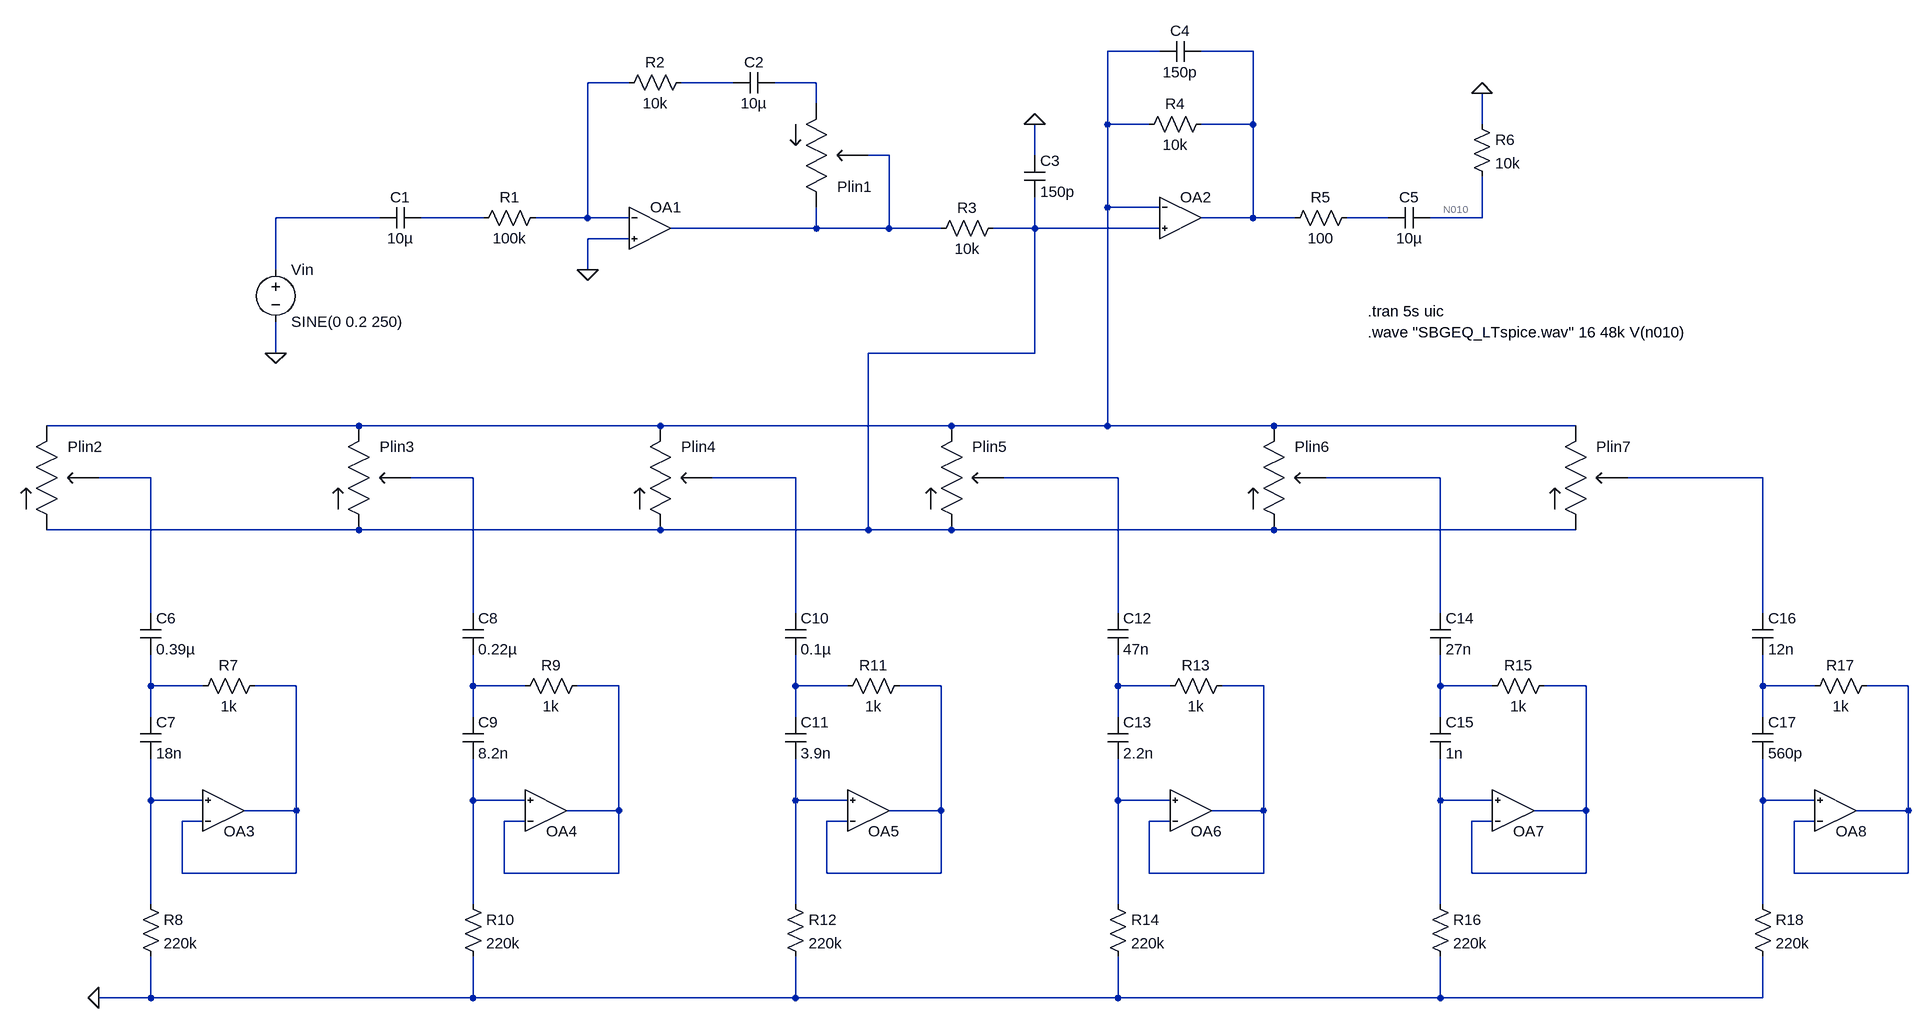
[diagram p0: schematic SBGEQ.asc]
SBGEQ.asc, the LTspice schematic file:
Version 4
SHEET 1 1816 1092
WIRE 336 -384 256 -384
WIRE 480 -384 400 -384
WIRE -480 -336 -544 -336
WIRE -320 -336 -400 -336
WIRE -192 -336 -256 -336
WIRE -192 -304 -192 -336
WIRE 256 -272 256 -384
WIRE 320 -272 256 -272
WIRE 480 -272 480 -384
WIRE 480 -272 400 -272
WIRE 832 -272 832 -320
WIRE -80 -224 -112 -224
WIRE 144 -224 144 -272
WIRE 256 -144 256 -272
WIRE 336 -144 256 -144
WIRE -864 -128 -1024 -128
WIRE -704 -128 -800 -128
WIRE -544 -128 -544 -336
WIRE -544 -128 -624 -128
WIRE -480 -128 -544 -128
WIRE 480 -128 480 -272
WIRE 480 -128 400 -128
WIRE 544 -128 480 -128
WIRE 688 -128 624 -128
WIRE 832 -128 832 -192
WIRE 832 -128 752 -128
WIRE -192 -112 -192 -144
WIRE -192 -112 -416 -112
WIRE -80 -112 -80 -224
WIRE -80 -112 -192 -112
WIRE 0 -112 -80 -112
WIRE 144 -112 144 -160
WIRE 144 -112 80 -112
WIRE 336 -112 144 -112
WIRE -480 -96 -544 -96
WIRE -1024 -48 -1024 -128
WIRE -544 -48 -544 -96
WIRE -1024 80 -1024 32
WIRE 144 80 144 -112
WIRE 144 80 -112 80
WIRE -896 192 -1376 192
WIRE -432 192 -896 192
WIRE 16 192 -432 192
WIRE 256 192 256 -144
WIRE 256 192 16 192
WIRE 512 192 256 192
WIRE 976 192 512 192
WIRE -1216 272 -1296 272
WIRE -720 272 -816 272
WIRE -224 272 -352 272
WIRE 272 272 96 272
WIRE 768 272 592 272
WIRE 1264 272 1056 272
WIRE -896 352 -1376 352
WIRE -432 352 -896 352
WIRE -112 352 -112 80
WIRE -112 352 -432 352
WIRE 16 352 -112 352
WIRE 512 352 16 352
WIRE 976 352 512 352
WIRE -1216 480 -1216 272
WIRE -720 480 -720 272
WIRE -224 480 -224 272
WIRE 272 480 272 272
WIRE 768 480 768 272
WIRE 1264 480 1264 272
WIRE -1216 592 -1216 544
WIRE -1136 592 -1216 592
WIRE -992 592 -1056 592
WIRE -720 592 -720 544
WIRE -640 592 -720 592
WIRE -496 592 -560 592
WIRE -224 592 -224 544
WIRE -144 592 -224 592
WIRE 0 592 -64 592
WIRE 272 592 272 544
WIRE 352 592 272 592
WIRE 496 592 432 592
WIRE 768 592 768 544
WIRE 848 592 768 592
WIRE 992 592 928 592
WIRE 1264 592 1264 544
WIRE 1344 592 1264 592
WIRE 1488 592 1424 592
WIRE -1216 640 -1216 592
WIRE -720 640 -720 592
WIRE -224 640 -224 592
WIRE 272 640 272 592
WIRE 768 640 768 592
WIRE 1264 640 1264 592
WIRE -1216 768 -1216 704
WIRE -1136 768 -1216 768
WIRE -720 768 -720 704
WIRE -640 768 -720 768
WIRE -224 768 -224 704
WIRE -144 768 -224 768
WIRE 272 768 272 704
WIRE 352 768 272 768
WIRE 768 768 768 704
WIRE 848 768 768 768
WIRE 1264 768 1264 704
WIRE 1344 768 1264 768
WIRE -992 784 -992 592
WIRE -992 784 -1072 784
WIRE -496 784 -496 592
WIRE -496 784 -576 784
WIRE 0 784 0 592
WIRE 0 784 -80 784
WIRE 496 784 496 592
WIRE 496 784 416 784
WIRE 992 784 992 592
WIRE 992 784 912 784
WIRE 1488 784 1488 592
WIRE 1488 784 1408 784
WIRE -1136 800 -1168 800
WIRE -640 800 -672 800
WIRE -144 800 -176 800
WIRE 352 800 320 800
WIRE 848 800 816 800
WIRE 1344 800 1312 800
WIRE -1168 880 -1168 800
WIRE -992 880 -992 784
WIRE -992 880 -1168 880
WIRE -672 880 -672 800
WIRE -496 880 -496 784
WIRE -496 880 -672 880
WIRE -176 880 -176 800
WIRE 0 880 0 784
WIRE 0 880 -176 880
WIRE 320 880 320 800
WIRE 496 880 496 784
WIRE 496 880 320 880
WIRE 816 880 816 800
WIRE 992 880 992 784
WIRE 992 880 816 880
WIRE 1312 880 1312 800
WIRE 1488 880 1488 784
WIRE 1488 880 1312 880
WIRE -1216 928 -1216 768
WIRE -720 928 -720 768
WIRE -224 928 -224 768
WIRE 272 928 272 768
WIRE 768 928 768 768
WIRE 1264 928 1264 768
WIRE -1216 1072 -1216 1008
WIRE -1216 1072 -1296 1072
WIRE -720 1072 -720 1008
WIRE -720 1072 -1216 1072
WIRE -224 1072 -224 1008
WIRE -224 1072 -720 1072
WIRE 272 1072 272 1008
WIRE 272 1072 -224 1072
WIRE 768 1072 768 1008
WIRE 768 1072 272 1072
WIRE 1264 1072 1264 1008
WIRE 1264 1072 768 1072
FLAG 144 -272 0
FLAG -1024 80 0
FLAG 832 -320 0
FLAG -544 -48 0
FLAG -1296 1072 0
SYMBOL voltage -1024 -64 R0
SYMATTR InstName Vin
SYMATTR Value SINE(0 0.2 250)
SYMBOL cap -800 -144 R90
WINDOW 0 0 32 VBottom 2
WINDOW 3 32 32 VTop 2
SYMATTR InstName C1
SYMATTR Value 10µ
SYMBOL res -608 -144 R90
WINDOW 0 0 56 VBottom 2
WINDOW 3 32 56 VTop 2
SYMATTR InstName R1
SYMATTR Value 100k
SYMBOL IdealOpamp -448 -112 R0
SYMATTR InstName OA1
SYMBOL res -384 -352 R90
WINDOW 0 0 56 VBottom 2
WINDOW 3 32 56 VTop 2
SYMATTR InstName R2
SYMATTR Value 10k
SYMBOL cap -256 -352 R90
WINDOW 0 0 32 VBottom 2
WINDOW 3 32 32 VTop 2
SYMATTR InstName C2
SYMATTR Value 10µ
SYMBOL LinearPotentiometer -192 -224 R0
SYMATTR InstName Plin1
SYMATTR SpiceLine Rp=250k x=0.5
SYMBOL res 96 -128 R90
WINDOW 0 0 56 VBottom 2
WINDOW 3 32 56 VTop 2
SYMATTR InstName R3
SYMATTR Value 10k
SYMBOL cap 128 -224 R0
SYMATTR InstName C3
SYMATTR Value 150p
SYMBOL IdealOpamp 368 -128 R0
SYMATTR InstName OA2
SYMBOL res 416 -288 R90
WINDOW 0 0 56 VBottom 2
WINDOW 3 32 56 VTop 2
SYMATTR InstName R4
SYMATTR Value 10k
SYMBOL cap 400 -400 R90
WINDOW 0 0 32 VBottom 2
WINDOW 3 32 32 VTop 2
SYMATTR InstName C4
SYMATTR Value 150p
SYMBOL res 640 -144 R90
WINDOW 0 0 56 VBottom 2
WINDOW 3 32 56 VTop 2
SYMATTR InstName R5
SYMATTR Value 100
SYMBOL cap 752 -144 R90
WINDOW 0 0 32 VBottom 2
WINDOW 3 32 32 VTop 2
SYMATTR InstName C5
SYMATTR Value 10µ
SYMBOL res 816 -288 R0
SYMATTR InstName R6
SYMATTR Value 10k
SYMBOL IdealOpamp -1104 784 M180
SYMATTR InstName OA3
SYMBOL LinearPotentiometer -1376 272 M180
SYMATTR InstName Plin2
SYMATTR SpiceLine Rp=5k x=0.5
SYMBOL cap -1232 480 R0
SYMATTR InstName C6
SYMATTR Value 0.39µ
SYMBOL cap -1232 640 R0
SYMATTR InstName C7
SYMATTR Value 18n
SYMBOL res -1040 576 R90
WINDOW 0 0 56 VBottom 2
WINDOW 3 32 56 VTop 2
SYMATTR InstName R7
SYMATTR Value 1k
SYMBOL res -1232 912 R0
SYMATTR InstName R8
SYMATTR Value 220k
SYMBOL IdealOpamp -608 784 M180
SYMATTR InstName OA4
SYMBOL LinearPotentiometer -896 272 M180
SYMATTR InstName Plin3
SYMATTR SpiceLine Rp=5k x=0.5
SYMBOL cap -736 480 R0
SYMATTR InstName C8
SYMATTR Value 0.22µ
SYMBOL cap -736 640 R0
SYMATTR InstName C9
SYMATTR Value 8.2n
SYMBOL res -544 576 R90
WINDOW 0 0 56 VBottom 2
WINDOW 3 32 56 VTop 2
SYMATTR InstName R9
SYMATTR Value 1k
SYMBOL res -736 912 R0
SYMATTR InstName R10
SYMATTR Value 220k
SYMBOL IdealOpamp -112 784 M180
SYMATTR InstName OA5
SYMBOL LinearPotentiometer -432 272 M180
SYMATTR InstName Plin4
SYMATTR SpiceLine Rp=5k x=0.5
SYMBOL cap -240 480 R0
SYMATTR InstName C10
SYMATTR Value 0.1µ
SYMBOL cap -240 640 R0
SYMATTR InstName C11
SYMATTR Value 3.9n
SYMBOL res -48 576 R90
WINDOW 0 0 56 VBottom 2
WINDOW 3 32 56 VTop 2
SYMATTR InstName R11
SYMATTR Value 1k
SYMBOL res -240 912 R0
SYMATTR InstName R12
SYMATTR Value 220k
SYMBOL IdealOpamp 384 784 M180
SYMATTR InstName OA6
SYMBOL LinearPotentiometer 16 272 M180
SYMATTR InstName Plin5
SYMATTR SpiceLine Rp=5k x=0.5
SYMBOL cap 256 480 R0
SYMATTR InstName C12
SYMATTR Value 47n
SYMBOL cap 256 640 R0
SYMATTR InstName C13
SYMATTR Value 2.2n
SYMBOL res 448 576 R90
WINDOW 0 0 56 VBottom 2
WINDOW 3 32 56 VTop 2
SYMATTR InstName R13
SYMATTR Value 1k
SYMBOL res 256 912 R0
SYMATTR InstName R14
SYMATTR Value 220k
SYMBOL IdealOpamp 880 784 M180
SYMATTR InstName OA7
SYMBOL LinearPotentiometer 512 272 M180
SYMATTR InstName Plin6
SYMATTR SpiceLine Rp=5k x=0.5
SYMBOL cap 752 480 R0
SYMATTR InstName C14
SYMATTR Value 27n
SYMBOL cap 752 640 R0
SYMATTR InstName C15
SYMATTR Value 1n
SYMBOL res 944 576 R90
WINDOW 0 0 56 VBottom 2
WINDOW 3 32 56 VTop 2
SYMATTR InstName R15
SYMATTR Value 1k
SYMBOL res 752 912 R0
SYMATTR InstName R16
SYMATTR Value 220k
SYMBOL IdealOpamp 1376 784 M180
SYMATTR InstName OA8
SYMBOL LinearPotentiometer 976 272 M180
SYMATTR InstName Plin7
SYMATTR SpiceLine Rp=5k x=0.5
SYMBOL cap 1248 480 R0
SYMATTR InstName C16
SYMATTR Value 12n
SYMBOL cap 1248 640 R0
SYMATTR InstName C17
SYMATTR Value 560p
SYMBOL res 1440 576 R90
WINDOW 0 0 56 VBottom 2
WINDOW 3 32 56 VTop 2
SYMATTR InstName R17
SYMATTR Value 1k
SYMBOL res 1248 912 R0
SYMATTR InstName R18
SYMATTR Value 220k
TEXT 656 16 Left 2 !.tran 5s uic
TEXT 656 48 Left 2 !.wave "SBGEQ_LTspice.wav" 16 48k V(n010)

The netlist it stands for:
* SBGEQ.asc
Vin N007 0 SINE(0 0.2 250)
C1 N008 N007 10µ
R1 N003 N008 100k
XOA1 N003 0 N006 IdealOpamp  ; pins 1 2 3
R2 N004 N003 10k
C2 N005 N004 10µ
XPlin1 N005 N006 N006 LinearPotentiometer Rp=250k x=0.5  ; pins 1 2 3
R3 N011 N006 10k
C3 0 N011 150p
XOA2 N001 N011 N002 IdealOpamp  ; pins 1 2 3
R4 N002 N001 10k
C4 N002 N001 150p
R5 N009 N002 100
C5 N010 N009 10µ
R6 0 N010 10k
XOA3 N019 N030 N019 IdealOpamp  ; pins 1 2 3
XPlin2 N011 N012 N001 LinearPotentiometer Rp=5k x=0.5  ; pins 1 2 3
C6 N012 N018 0.39µ
C7 N018 N030 18n
R7 N019 N018 1k
R8 N030 0 220k
XOA4 N021 N031 N021 IdealOpamp  ; pins 1 2 3
XPlin3 N011 N013 N001 LinearPotentiometer Rp=5k x=0.5  ; pins 1 2 3
C8 N013 N020 0.22µ
C9 N020 N031 8.2n
R9 N021 N020 1k
R10 N031 0 220k
XOA5 N023 N032 N023 IdealOpamp  ; pins 1 2 3
XPlin4 N011 N014 N001 LinearPotentiometer Rp=5k x=0.5  ; pins 1 2 3
C10 N014 N022 0.1µ
C11 N022 N032 3.9n
R11 N023 N022 1k
R12 N032 0 220k
XOA6 N025 N033 N025 IdealOpamp  ; pins 1 2 3
XPlin5 N011 N015 N001 LinearPotentiometer Rp=5k x=0.5  ; pins 1 2 3
C12 N015 N024 47n
C13 N024 N033 2.2n
R13 N025 N024 1k
R14 N033 0 220k
XOA7 N027 N034 N027 IdealOpamp  ; pins 1 2 3
XPlin6 N011 N016 N001 LinearPotentiometer Rp=5k x=0.5  ; pins 1 2 3
C14 N016 N026 27n
C15 N026 N034 1n
R15 N027 N026 1k
R16 N034 0 220k
XOA8 N029 N035 N029 IdealOpamp  ; pins 1 2 3
XPlin7 N011 N017 N001 LinearPotentiometer Rp=5k x=0.5  ; pins 1 2 3
C16 N017 N028 12n
C17 N028 N035 560p
R17 N029 N028 1k
R18 N035 0 220k
.tran 5s uic
.wave "SBGEQ_LTspice.wav" 16 48k V(n010)
.backanno
.end